# EAGLE schematic PBC-1 (EAGLE 7.1.0)
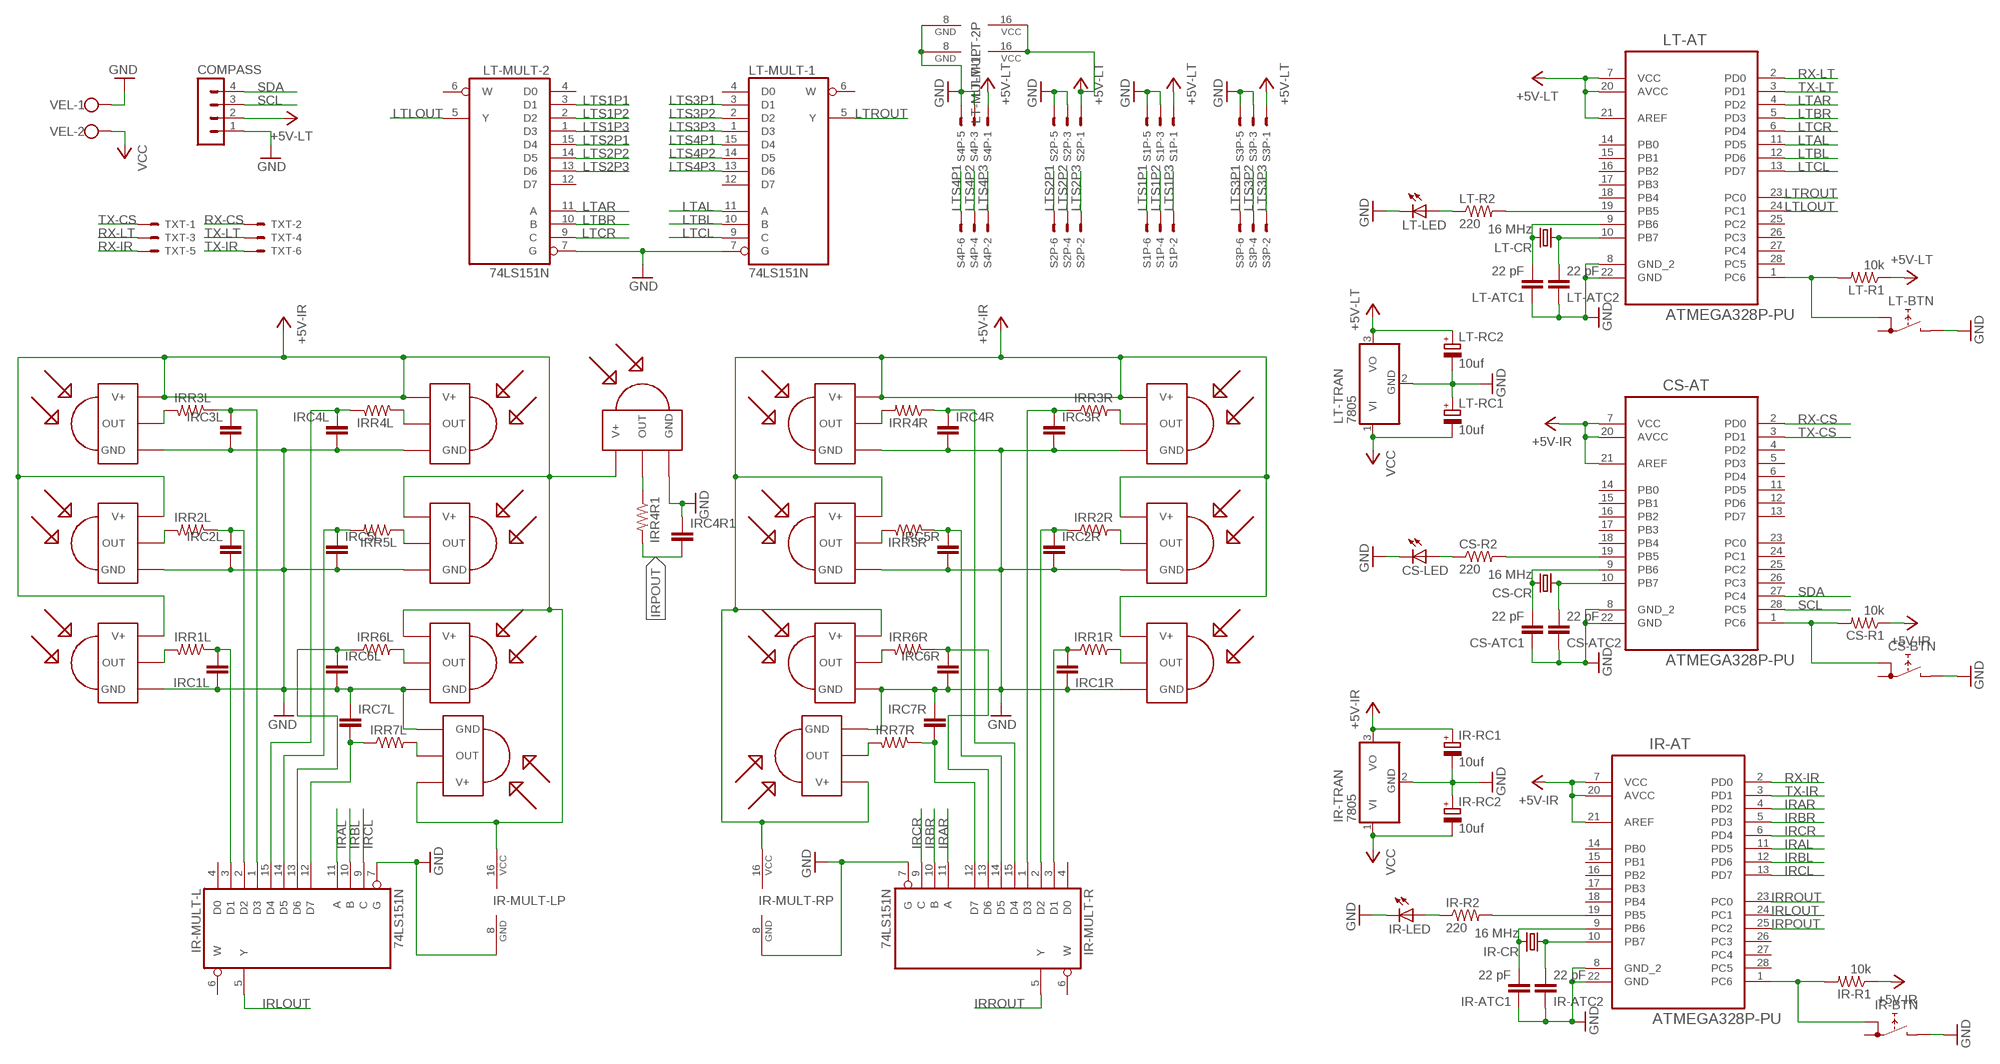
[diagram p0: schematic, sheet 1]

## Parts
COMPASS  MA04-1  [MA04-1]
CS-AT  ATMEGA328P-PU  [DIP254P762X457-28]
CS-ATC1  22 pF  C2,5-3  [C2.5-3]
CS-ATC2  22 pF  C2,5-3  [C2.5-3]
CS-BTN  RDT1034  [RDT1034]
CS-CR  16 MHz  CRYSTALHC49U70  [HC49U70]
CS-LED  LED5MM  [LED5MM]
CS-R1  10k  R-US_0204/7  [0204/7]
CS-R2  220  R-US_0204/7  [0204/7]
IR-AT  ATMEGA328P-PU  [DIP254P762X457-28]
IR-ATC1  22 pF  C2,5-3  [C2.5-3]
IR-ATC2  22 pF  C2,5-3  [C2.5-3]
IR-BTN  RDT1034  [RDT1034]
IR-CR  16 MHz  CRYSTALHC49U70  [HC49U70]
IR-LED  LED5MM  [LED5MM]
IR-MULT-L  74LS151N  [DIL16]
IR-MULT-R  74LS151N  [DIL16]
IR-R1  10k  R-US_0204/7  [0204/7]
IR-R2  220  R-US_0204/7  [0204/7]
IR-RC1  10uf  CPOL-EUTT5D9  [TT5D9]
IR-RC2  10uf  CPOL-EUTT5D9  [TT5D9]
IR-TRAN  7805  7805T  [TO220H]
IRC1L  C-EU025-024X044  [C025-024X044]
IRC1R  C-EU025-024X044  [C025-024X044]
IRC2L  C-EU025-024X044  [C025-024X044]
IRC2R  C-EU025-024X044  [C025-024X044]
IRC3L  C-EU025-024X044  [C025-024X044]
IRC3R  C-EU025-024X044  [C025-024X044]
IRC4L  C-EU025-024X044  [C025-024X044]
IRC4R  C-EU025-024X044  [C025-024X044]
IRC4R1  C-EU025-024X044  [C025-024X044]
IRC5L  C-EU025-024X044  [C025-024X044]
IRC5R  C-EU025-024X044  [C025-024X044]
IRC6L  C-EU025-024X044  [C025-024X044]
IRC6R  C-EU025-024X044  [C025-024X044]
IRC7L  C-EU025-024X044  [C025-024X044]
IRC7R  C-EU025-024X044  [C025-024X044]
IRD1L  TSOP2240  TSOP1840  [TSOP18XX]
IRD1R  TSOP2240  TSOP1840  [TSOP18XX]
IRD2L  TSOP2240  TSOP1840  [TSOP18XX]
IRD2R  TSOP2240  TSOP1840  [TSOP18XX]
IRD3L  TSOP2240  TSOP1840  [TSOP18XX]
IRD3R  TSOP1840  [TSOP18XX]
IRD4L  TSOP2240  TSOP1840  [TSOP18XX]
IRD4R  TSOP2240  TSOP1840  [TSOP18XX]
IRD5L  TSOP2240  TSOP1840  [TSOP18XX]
IRD5R  TSOP2240  TSOP1840  [TSOP18XX]
IRD6L  TSOP2240  TSOP1840  [TSOP18XX]
IRD6R  TSOP2240  TSOP1840  [TSOP18XX]
IRD7L  TSOP2240  TSOP1840  [TSOP18XX]
IRD7R  TSOP2240  TSOP1840  [TSOP18XX]
IRDP  TSOP2240  TSOP1840  [TSOP18XX]
IRR1L  R-US_0204/5  [0204/5]
IRR1R  R-US_0204/5  [0204/5]
IRR2L  R-US_0204/5  [0204/5]
IRR2R  R-US_0204/5  [0204/5]
IRR3L  R-US_0204/5  [0204/5]
IRR3R  R-US_0204/5  [0204/5]
IRR4L  R-US_0204/5  [0204/5]
IRR4R  R-US_0204/5  [0204/5]
IRR4R1  R-US_0204/5  [0204/5]
IRR5L  R-US_0204/5  [0204/5]
IRR5R  R-US_0204/5  [0204/5]
IRR6L  R-US_0204/5  [0204/5]
IRR6R  R-US_0204/5  [0204/5]
IRR7L  R-US_0204/5  [0204/5]
IRR7R  R-US_0204/5  [0204/5]
LT-AT  ATMEGA328P-PU  [DIP254P762X457-28]
LT-ATC1  22 pF  C2,5-3  [C2.5-3]
LT-ATC2  22 pF  C2,5-3  [C2.5-3]
LT-BTN  RDT1034  [RDT1034]
LT-CR  16 MHz  CRYSTALHC49U70  [HC49U70]
LT-LED  LED5MM  [LED5MM]
LT-MULT-1  74LS151N  [DIL16]
LT-MULT-2  74LS151N  [DIL16]
LT-R1  10k  R-US_0204/7  [0204/7]
LT-R2  220  R-US_0204/7  [0204/7]
LT-RC1  10uf  CPOL-EUTT5D9  [TT5D9]
LT-RC2  10uf  CPOL-EUTT5D9  [TT5D9]
LT-TRAN  7805  7805T  [TO220H]
S1P  332-06  [332-06]
S2P  332-06  [332-06]
S3P  332-06  [332-06]
S4P  332-06  [332-06]
TXT  87758-0616  [87758-0616]
VEL  W237-102  [W237-102]

## Nets
+5V-IR: CS-AT.7(VCC) CS-AT.20(AVCC) CS-AT.21(AREF) CS-R1.1 IR-AT.7(VCC) IR-AT.20(AVCC) IR-AT.21(AREF) IR-MULT-L.16(VCC) IR-MULT-R.16(VCC) IR-R1.1 IR-RC1.+ IR-TRAN.3(VO) IRD1L.VCC(V+) IRD1R.VCC(V+) IRD2L.VCC(V+) IRD2R.VCC(V+) IRD3L.VCC(V+) IRD3R.VCC(V+) IRD4L.VCC(V+) IRD4R.VCC(V+) IRD5L.VCC(V+) IRD5R.VCC(V+) IRD6L.VCC(V+) IRD6R.VCC(V+) IRD7L.VCC(V+) IRD7R.VCC(V+) IRDP.VCC(V+)
+5V-LT: COMPASS.2 LT-AT.7(VCC) LT-AT.20(AVCC) LT-AT.21(AREF) LT-MULT-1.16(VCC) LT-MULT-2.16(VCC) LT-R1.1 LT-RC2.+ LT-TRAN.3(VO) S1P.1 S2P.1 S3P.1 S4P.1
GND: COMPASS.1 CS-AT.8(GND_2) CS-AT.22(GND) CS-ATC1.1 CS-ATC2.1 CS-BTN.B CS-LED.K(C) IR-AT.8(GND_2) IR-AT.22(GND) IR-ATC1.1 IR-ATC2.1 IR-BTN.B IR-LED.K(C) IR-MULT-L.7(G) IR-MULT-L.8(GND) IR-MULT-R.7(G) IR-MULT-R.8(GND) IR-RC1.- IR-RC2.+ IR-TRAN.2(GND) IRC1L.1 IRC1R.1 IRC2L.2 IRC2R.2 IRC3L.2 IRC3R.2 IRC4L.2 IRC4R1.1 IRC4R.2 IRC5L.2 IRC5R.2 IRC6L.2 IRC6R.2 IRC7L.1 IRC7R.1 IRD1L.GND IRD1R.GND IRD2L.GND IRD2R.GND IRD3L.GND IRD3R.GND IRD4L.GND IRD4R.GND IRD5L.GND IRD5R.GND IRD6L.GND IRD6R.GND IRD7L.GND IRD7R.GND IRDP.GND LT-AT.8(GND_2) LT-AT.22(GND) LT-ATC1.1 LT-ATC2.1 LT-BTN.B LT-LED.K(C) LT-MULT-1.7(G) LT-MULT-1.8(GND) LT-MULT-2.7(G) LT-MULT-2.8(GND) LT-RC1.+ LT-RC2.- LT-TRAN.2(GND) S1P.3 S1P.5 S2P.3 S2P.5 S3P.3 S3P.5 S4P.3 S4P.5 VEL.1
IR-CR: IR-AT.9(PB6) IR-ATC1.2 IR-CR.2
IRAL: IR-AT.11(PD5) IR-MULT-L.11(A)
IRAR: IR-AT.4(PD2) IR-MULT-R.11(A)
IRBL: IR-AT.12(PD6) IR-MULT-L.10(B)
IRBR: IR-AT.5(PD3) IR-MULT-R.10(B)
IRCL: IR-AT.13(PD7) IR-MULT-L.9(C)
IRCR: IR-AT.6(PD4) IR-MULT-R.9(C)
IRLOUT: IR-AT.24(PC1) IR-MULT-L.5(Y)
IRPOUT: IR-AT.25(PC2) IRC4R1.2 IRR4R1.2
IRROUT: IR-AT.23(PC0) IR-MULT-R.5(Y)
LTAL: LT-AT.11(PD5) LT-MULT-1.11(A)
LTAR: LT-AT.4(PD2) LT-MULT-2.11(A)
LTBL: LT-AT.12(PD6) LT-MULT-1.10(B)
LTBR: LT-AT.5(PD3) LT-MULT-2.10(B)
LTCL: LT-AT.13(PD7) LT-MULT-1.9(C)
LTCR: LT-AT.6(PD4) LT-MULT-2.9(C)
LTLOUT: LT-AT.24(PC1) LT-MULT-2.5(Y)
LTROUT: LT-AT.23(PC0) LT-MULT-1.5(Y)
LTS1P1: LT-MULT-2.3(D1) S1P.6
LTS1P2: LT-MULT-2.2(D2) S1P.4
LTS1P3: LT-MULT-2.1(D3) S1P.2
LTS2P1: LT-MULT-2.15(D4) S2P.6
LTS2P2: LT-MULT-2.14(D5) S2P.4
LTS2P3: LT-MULT-2.13(D6) S2P.2
LTS3P1: LT-MULT-1.3(D1) S3P.6
LTS3P2: LT-MULT-1.2(D2) S3P.4
LTS3P3: LT-MULT-1.1(D3) S3P.2
LTS4P1: LT-MULT-1.15(D4) S4P.6
LTS4P2: LT-MULT-1.14(D5) S4P.4
LTS4P3: LT-MULT-1.13(D6) S4P.2
N$1: IR-LED.A IR-R2.1
N$2: IR-AT.19(PB5) IR-R2.2
N$3: IR-MULT-R.3(D1) IRC1R.2 IRR1R.1
N$4: IRD4R.OUT IRR4R.2
N$5: IR-MULT-R.1(D3) IRC3R.1 IRR3R.1
N$6: IR-MULT-R.15(D4) IRC4R.1 IRR4R.1
N$7: IRD7R.OUT IRR7R.2
N$8: IRD5R.OUT IRR5R.1
N$9: IRD2R.OUT IRR2R.2
N$10: IR-MULT-L.3(D1) IRC1L.2 IRR1L.1
N$11: IRD3R.OUT IRR3R.2
N$12: IR-MULT-R.2(D2) IRC2R.1 IRR2R.1
N$13: IRD1R.OUT IRR1R.2
N$14: IRD6R.OUT IRR6R.2
N$15: IR-MULT-R.14(D5) IRC5R.1 IRR5R.2
N$16: IR-MULT-R.13(D6) IRC6R.1 IRR6R.1
N$17: IR-MULT-R.12(D7) IRC7R.2 IRR7R.1
N$18: IR-MULT-L.1(D3) IRC3L.1 IRR3L.1
N$19: IR-MULT-L.15(D4) IRC4L.1 IRR4L.1
N$20: IRD3L.OUT IRR3L.2
N$21: IRD2L.OUT IRR2L.2
N$22: IR-MULT-L.2(D2) IRC2L.1 IRR2L.1
N$23: IRD1L.OUT IRR1L.2
N$24: IRD4L.OUT IRR4L.2
N$25: IRD5L.OUT IRR5L.1
N$26: IR-MULT-L.14(D5) IRC5L.1 IRR5L.2
N$27: IRD6L.OUT IRR6L.2
N$28: IR-MULT-L.13(D6) IRC6L.1 IRR6L.1
N$29: IRD7L.OUT IRR7L.2
N$30: IR-MULT-L.12(D7) IRC7L.2 IRR7L.1
N$31: LT-LED.A LT-R2.1
N$32: LT-AT.19(PB5) LT-R2.2
N$33: IRDP.OUT IRR4R1.1
N$34: CS-LED.A CS-R2.1
N$35: CS-AT.19(PB5) CS-R2.2
PB6-A2: LT-AT.9(PB6) LT-ATC1.2 LT-CR.2
PB6-A3: CS-AT.9(PB6) CS-ATC1.2 CS-CR.2
PB7-A1: IR-AT.10(PB7) IR-ATC2.2 IR-CR.1
PB7-A2: LT-AT.10(PB7) LT-ATC2.2 LT-CR.1
PB7-A3: CS-AT.10(PB7) CS-ATC2.2 CS-CR.1
RESET-AT1: IR-AT.1(PC6) IR-BTN.A IR-R1.2
RESET-AT2: LT-AT.1(PC6) LT-BTN.A LT-R1.2
RESET-AT3: CS-AT.1(PC6) CS-BTN.A CS-R1.2
RX-CS: CS-AT.2(PD0) TXT.2
RX-IR: IR-AT.2(PD0) TXT.5
RX-LT: LT-AT.2(PD0) TXT.3
SCL: COMPASS.3 CS-AT.28(PC5)
SDA: COMPASS.4 CS-AT.27(PC4)
TX-CS: CS-AT.3(PD1) TXT.1
TX-IR: IR-AT.3(PD1) TXT.6
TX-LT: LT-AT.3(PD1) TXT.4
VCC: IR-RC2.- IR-TRAN.1(VI) LT-RC1.- LT-TRAN.1(VI) VEL.2
Unconnected: CS-AT.4(PD2) CS-AT.5(PD3) CS-AT.6(PD4) CS-AT.11(PD5) CS-AT.12(PD6) CS-AT.13(PD7) CS-AT.14(PB0) CS-AT.15(PB1) CS-AT.16(PB2) CS-AT.17(PB3) CS-AT.18(PB4) CS-AT.23(PC0) CS-AT.24(PC1) CS-AT.25(PC2) CS-AT.26(PC3) CS-BTN.A1 IR-AT.14(PB0) IR-AT.15(PB1) IR-AT.16(PB2) IR-AT.17(PB3) IR-AT.18(PB4) IR-AT.26(PC3) IR-AT.27(PC4) IR-AT.28(PC5) IR-BTN.A1 IR-MULT-L.4(D0) IR-MULT-L.6(W) IR-MULT-R.4(D0) IR-MULT-R.6(W) LT-AT.14(PB0) LT-AT.15(PB1) LT-AT.16(PB2) LT-AT.17(PB3) LT-AT.18(PB4) LT-AT.25(PC2) LT-AT.26(PC3) LT-AT.27(PC4) LT-AT.28(PC5) LT-BTN.A1 LT-MULT-1.4(D0) LT-MULT-1.6(W) LT-MULT-1.12(D7) LT-MULT-2.4(D0) LT-MULT-2.6(W) LT-MULT-2.12(D7)

## Library data of the parts
COMPASS = con-lstb:MA04-1: PIN HEADER; OC_FARNELL: unknown; OC_NEWARK: unknown
CS-AT IR-AT LT-AT = Atmel_By_element14_Batch_1-00:ATMEGA328P-PU: 8-bit Microcontroller with In-System Programmable Flash; MPN: ATMEGA328P-PU; OC_FARNELL: 1715487; OC_NEWARK: 15R0268; PACKAGE: PDIP-28; SUPPLIER: Atmel
CS-ATC1 CS-ATC2 IR-ATC1 IR-ATC2 LT-ATC1 LT-ATC2 = capacitor-wima:C: CAPACITOR naming: grid - package width
CS-BTN IR-BTN LT-BTN = switch:RDT1034: PUSH SWITCH www.radiohm.com
CS-CR IR-CR LT-CR = crystal:CRYSTAL: CRYSTAL; OC_FARNELL: unknown; OC_NEWARK: unknown
CS-LED IR-LED LT-LED = led:LED: LED OSRAM: - CHIPLED LG R971, LG N971, LY N971, LG Q971, LY Q971, LO R971, LY R971 LH N974, LH R974 LS Q976, LO Q976, LY Q976 LO Q996 - Hyper CHIPLED LW Q18S LB Q993, LB Q99A, LB R99A - SideLED LS A670, LO A670, LY A670, LG A670, LP A670 LB A673, LV A673, LT A673, LW A673 LH A674 LY A675 LS A676, LA A676, LO A676, LY A676, LW A676 LS A679, LY A679, LG A679 - Hyper Micro SIDELED® LS Y876, LA Y876, LO Y876, LY Y876 LT Y87S - SmartLED LW L88C, LW L88S LB L89C, LB L89S, LG L890 LS L89K, LO L89K, LY L89K LS L896, LA L896, LO L896, LY L896 - TOPLED LS T670, LO T670, LY T670, LG T670, LP T670 LSG T670, LSP T670, LSY T670, LOP T670, LYG T670 LG T671, LOG T671, LSG T671 LB T673, LV T673, LT T673, LW T673 LH T674 LS T676, LA T676, LO T676, LY T676, LB T676, LH T676, LSB T676, LW T676 LB T67C, LV T67C, LT T67C, LS T67K, LO T67K, LY T67K, LW E67C LS E67B, LA E67B, LO E67B, LY E67B, LB E67C, LV E67C, LT E67C LW T67C LS T679, LY T679, LG T679 LS T770, LO T770, LY T770, LG T770, LP T770 LB T773, LV T773, LT T773, LW T773 LH T774 LS E675, LA E675, LY E675, LS T675 LS T776, LA T776, LO T776, LY T776, LB T776 LHGB T686 LT T68C, LB T68C - Hyper Mini TOPLED® LB M676 - Mini TOPLED Santana® LG M470 LS M47K, LO M47K, LY M47K Source: http://www.osram.convergy.de LUXEON: - LUMILED® LXK2-PW12-R00, LXK2-PW12-S00, LXK2-PW14-U00, LXK2-PW14-V00 LXK2-PM12-R00, LXK2-PM12-S00, LXK2-PM14-U00 LXK2-PE12-Q00, LXK2-PE12-R00, LXK2-PE12-S00, LXK2-PE14-T00, LXK2-PE14-U00 LXK2-PB12-K00, LXK2-PB12-L00, LXK2-PB12-M00, LXK2-PB14-N00, LXK2-PB14-P00, LXK2-PB14-Q00 LXK2-PR12-L00, LXK2-PR12-M00, LXK2-PR14-Q00, LXK2-PR14-R00 LXK2-PD12-Q00, LXK2-PD12-R00, LXK2-PD12-S00 LXK2-PH12-R00, LXK2-PH12-S00 LXK2-PL12-P00, LXK2-PL12-Q00, LXK2-PL12-R00 Source: www.luxeon.com KINGBRIGHT: KA-3528ASYC Source: www.kingbright.com
CS-R1 CS-R2 IR-R1 IR-R2 IRR1L IRR1R IRR2L IRR2R IRR3L IRR3R IRR4L IRR4R IRR4R1 IRR5L IRR5R IRR6L IRR6R IRR7L IRR7R LT-R1 LT-R2 = rcl:R-US_: RESISTOR, American symbol
IR-MULT-L IR-MULT-R LT-MULT-1 LT-MULT-2 = 74xx-us:74*151: Data SELECTOR/MULTIPLEXER
IR-RC1 IR-RC2 LT-RC1 LT-RC2 = resistor:CPOL-EU: POLARIZED CAPACITOR, European symbol
IR-TRAN LT-TRAN = linear:78*: Positive VOLTAGE REGULATOR Source: http://cache.national.com/ds/LM/LM78L05.pdf http://www.fairchildsemi.com/ds/LM/LM7805.pdf
IRC1L IRC1R IRC2L IRC2R IRC3L IRC3R IRC4L IRC4R IRC4R1 IRC5L IRC5R IRC6L IRC6R IRC7L IRC7R = rcl:C-EU: CAPACITOR, European symbol
IRD1L IRD1R IRD2L IRD2R IRD3L IRD3R IRD4L IRD4R IRD5L IRD5R IRD6L IRD6R IRD7L IRD7R IRDP = tsop:TSOP1840: IR Receiver and Demodulator
S1P S2P S3P S4P = con-garry:332-06: 6 Pin - 2mm Dual Row Source: www.mpe-connector.de / garry_shortform_2012.pdf
TXT = con-molex:87758-0616: 6 Pin - 2mm Dual Row Single Wafer, Vertical T/H HDR Source: http://www.molex.com/pdm_docs/sd/877580616_sd.pdf; MPN: 87758-0616; OC_FARNELL: 7472323; OC_NEWARK: 25M5667
VEL = con-wago-500:W237-102: WAGO SCREW CLAMP; MPN: 237-102; OC_FARNELL: unknown; OC_NEWARK: 70K9898